# Altium project RX_BK9532Board.PrjPCB
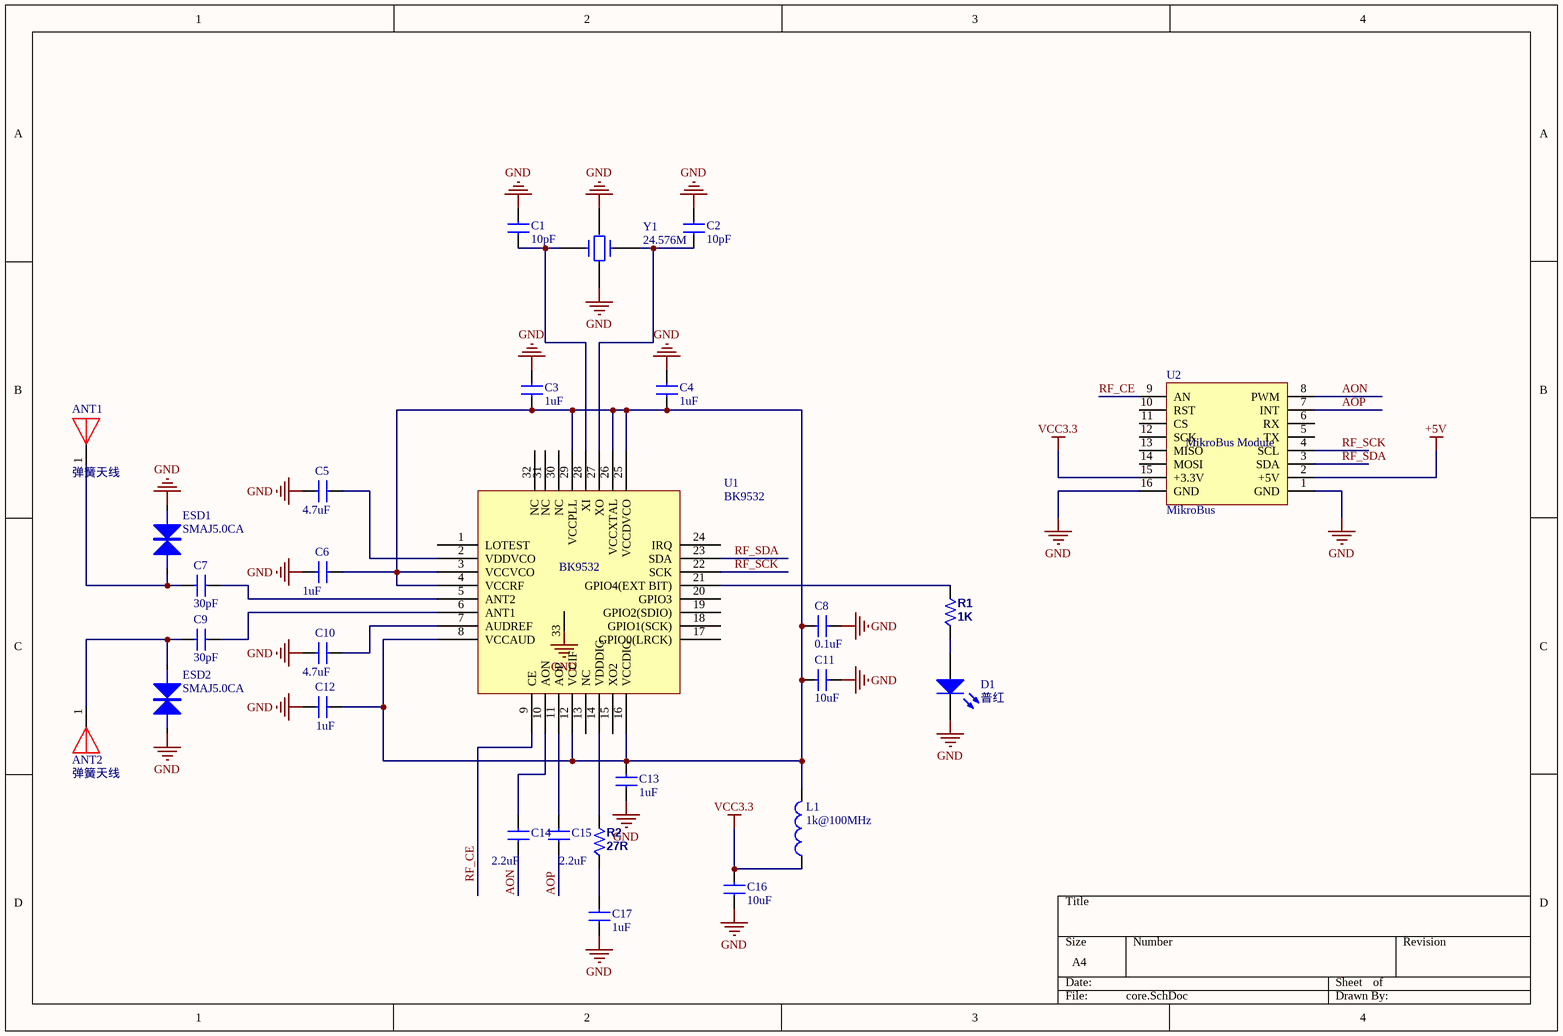
[diagram p0: core.SchDoc]
1 sheet, 28 parts. Net scope: global (net labels, ports and power ports of the same name join across sheets).
Board file: BK5932.PcbDoc

## Sheet core.SchDoc
size A4

### Parts
ANT1  弹簧天线  [ANT]
ANT2  弹簧天线  [ANT]
C1  10pF  [C0603]
C2  10pF  [C0603]
C3  1uF  [C0603]
C4  1uF  [C0603]
C5  4.7uF  [C0603]
C6  1uF  [C0603]
C7  30pF  [C0603]
C8  0.1uF  [C0603]
C9  30pF  [C0603]
C10  4.7uF  [C0603]
C11  10uF  [C0603]
C12  1uF  [C0603]
C13  1uF  [C0603]
C14  2.2uF  [C0603]
C15  2.2uF  [C0603]
C16  10uF  [C0603]
C17  1uF  [C0603]
D1  普红  [LED 0805]
ESD1  SMAJ5.0CA  [SMAJ]
ESD2  SMAJ5.0CA  [SMAJ]
L1  1k@100MHz  [L0603]
R1  1K  [R0603]
R2  27R  [R0603]
U1  BK9532  [QFN32]
U2  MikroBus  [MikroBus]
Y1  24.576M  [晶振   有源2520]

### Nets
+5V: U2.2(+5V)
GND: C1.1 C2.1 C3.2 C4.2 C5.1 C6.1 C8.1 C10.1 C11.1 C12.1 C13.1 C16.1 C17.1 D1.2(K) ESD1.1 ESD2.1 U1.33 U2.1(GND) U2.16(GND) Y1.2 Y1.4
VCC3.3: C16.2 L1.1 U2.15(+3.3V)
AON: C14.1 U2.8(PWM)
AOP: C15.1 U2.7(INT)
RF_CE: U1.9(CE) U2.9(AN)
RF_SCK: U1.22(SCK) U2.4(SCL)
RF_SDA: U1.23(SDA) U2.3(SDA)
NetANT1_1: ANT1.1 C7.1 ESD1.2
NetANT2_1: ANT2.1 C9.1 ESD2.2
NetC1_2: C1.2 U1.28(XI) Y1.1
NetC2_2: C2.2 U1.27(XO) Y1.3
NetC3_1: C3.1 C4.1 C6.2 C8.2 C11.2 C12.2 C13.2 L1.2 U1.3(VCCVCO) U1.4(VCCRF) U1.8(VCCAUD) U1.12(VCCIF) U1.16(VCCDIG) U1.25(VCCDVCO) U1.26(VCCXTAL) U1.29(VCCPLL)
NetC5_2: C5.2 U1.2(VDDVCO)
NetC7_2: C7.2 U1.5(ANT2)
NetC9_2: C9.2 U1.6(ANT1)
NetC10_2: C10.2 U1.7(AUDREF)
NetC14_2: C14.2 U1.10(AON)
NetC15_2: C15.2 U1.11(AOP)
NetC17_2: C17.2 R2.1
NetD1_1: D1.1(A) R1.1
NetR1_2: R1.2 U1.21(GPIO4(EXT_BIT))
NetR2_2: R2.2 U1.14(VDDDIG)

Not connected (* = marked no-connect by the designer): U1 1(LOTEST) 13(NC) 15(XO2) 17(GPIO0(LRCK)) 18(GPIO1(SCK)) 19(GPIO2(SDIO)) 20(GPIO3) 24(IRQ) 30(NC) 31(NC) 32(NC); U2 5(TX) 6(RX) 10(RST) 11(CS) 12(SCK) 13(MISO) 14(MOSI)

### Notes on the sheet
- (in symbol MikroBus) MikroBus Module

### Library data of the parts
ANT1 ANT2 = ANT
C1 C2 = CAP 0603-10pF/50V: 0603-10pF/50V 贴片层叠电容; 物料代码: 3.01.02.02.01.01.0028; 助记码: 0603-10pF/50V TPCDDR; 仓库名称: 元件仓; 单位: 只; 加工类型: 贴片; 物料名称: 0603-10pF/50V 贴片层叠电容; 规格型号: *
C3-C6 C8 C10-C17 = CAP 0805-68pF/50V: 0805-68pF/50V-J5%贴片层叠电容; 物料代码: 3.01.02.02.01.03.0006; 助记码: 0805-68pF/50V-J5%TPCDDR; 仓库名称: 元件仓; 单位: 只; 加工类型: 贴片; 物料名称: 0805-68pF/50V-J5%贴片层叠电容; 规格型号: *
C7 C9 = CAP 0603-33pF/50V: 0603-33pF/50V   贴片层叠电容; 物料代码: 3.01.02.02.01.01.0037; 助记码: 0603-33pF/50V   TPCD; 仓库名称: 元件仓; 单位: 只; 加工类型: 贴片; 物料名称: 0603-33pF/50V   贴片层叠电容; 规格型号: *
D1 = LED  0805普亮贴片红灯: 0805普亮贴片红灯; 单位: 只; 物料代码: 3.01.13.01.0001; 助记码: 0805PLTPHD; 仓库名称: 元件仓; 加工方式: 贴片; 物料名称: 0805普亮贴片红灯; 规格型号: *
ESD1 ESD2 = ESD 防浪涌二极管: ESD 二极管; 单位: 只; 规格型号: LL-34; 物料名称: ZMM3V3  1/2W 贴片稳压二极管; 物料代码: 3.01.05.02.0001; 仓库名称: 元件仓; 加工方式: 贴片
L1 = 电感  贴片  33UH: 磁珠; 物料名称: *; 物料代码: *; 备注: *; 助记码: *; 单位: *; 规格型号: *
R1 R2 = RES1: 1206  K  5%  HS  贴片电阻
U1 = BK9532: QFN5x5 32
Y1 = 晶振  24.576MHz  49SMD: （未入库）24.576MHz  2520; 仓库名称: 元件仓; 单位: 只; 加工方式: 贴片